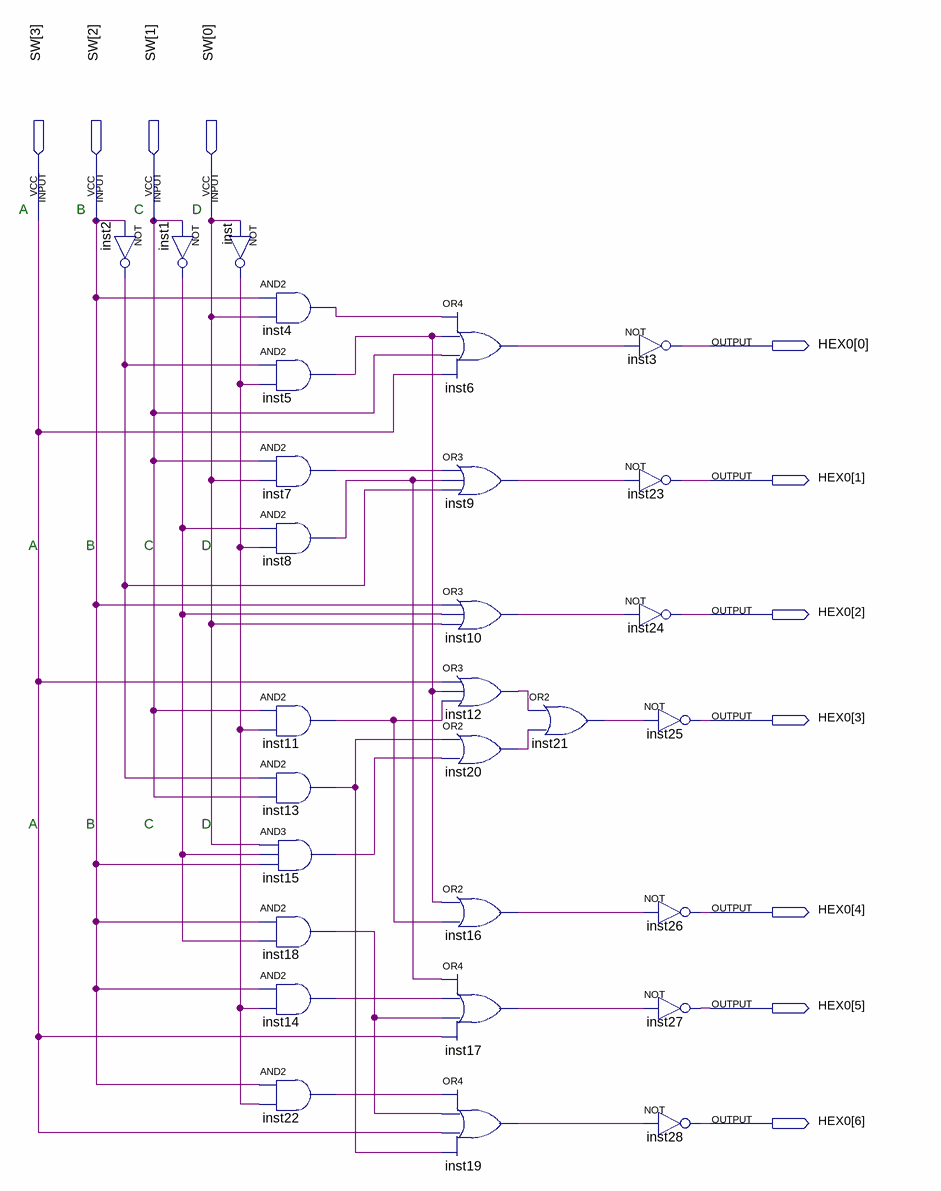
[diagram p0: schematic sheet]
// Quartus schematic SevenSegmentDecoderLab.bdf as structural Verilog: 29 symbols, 11 pins
module SevenSegmentDecoderLab (
  input  [3:0] SW,
  output [6:0] HEX0
);

  wire inst1_out, inst2_out, inst4_out, inst5_out, inst6_out, inst7_out, inst8_out, inst9_out, inst10_out,
       inst11_out, inst12_out, inst13_out, inst14_out, inst15_out, inst16_out, inst17_out, inst18_out,
       inst19_out, inst20_out, inst21_out, inst22_out, inst_out;

  not inst1 (inst1_out, SW[1]);
  not inst2 (inst2_out, SW[2]);
  not inst (inst_out, SW[0]);
  and inst4 (inst4_out, SW[2], SW[0]);
  and inst5 (inst5_out, inst2_out, inst_out);
  and inst7 (inst7_out, SW[1], SW[0]);
  and inst8 (inst8_out, inst1_out, inst_out);
  and inst11 (inst11_out, SW[1], inst_out);
  and inst13 (inst13_out, inst2_out, SW[1]);
  and inst15 (inst15_out, SW[0], inst1_out, SW[2]);
  and inst18 (inst18_out, SW[2], inst1_out);
  and inst14 (inst14_out, SW[2], inst_out);
  and inst22 (inst22_out, SW[2], inst_out);
  or inst6 (inst6_out, inst4_out, inst5_out, SW[1], SW[3]);
  or inst9 (inst9_out, inst7_out, inst8_out, inst2_out);
  or inst10 (inst10_out, SW[2], inst1_out, SW[0]);
  or inst12 (inst12_out, SW[3], inst5_out, inst11_out);
  or inst20 (inst20_out, inst13_out, inst15_out);
  or inst16 (inst16_out, inst5_out, inst11_out);
  or inst17 (inst17_out, inst8_out, inst14_out, inst18_out, SW[3]);
  or inst19 (inst19_out, inst22_out, inst18_out, SW[3], inst13_out);
  or inst21 (inst21_out, inst12_out, inst20_out);
  not inst3 (HEX0[0], inst6_out);
  not inst23 (HEX0[1], inst9_out);
  not inst24 (HEX0[2], inst10_out);
  not inst25 (HEX0[3], inst21_out);
  not inst26 (HEX0[4], inst16_out);
  not inst27 (HEX0[5], inst17_out);
  not inst28 (HEX0[6], inst19_out);

  // Notes on the sheet:
  //   A
  //   B
  //   C
  //   D
  //   A
  //   B
  //   C
  //   D
  //   A
  //   B
  //   C
  //   D
endmodule
